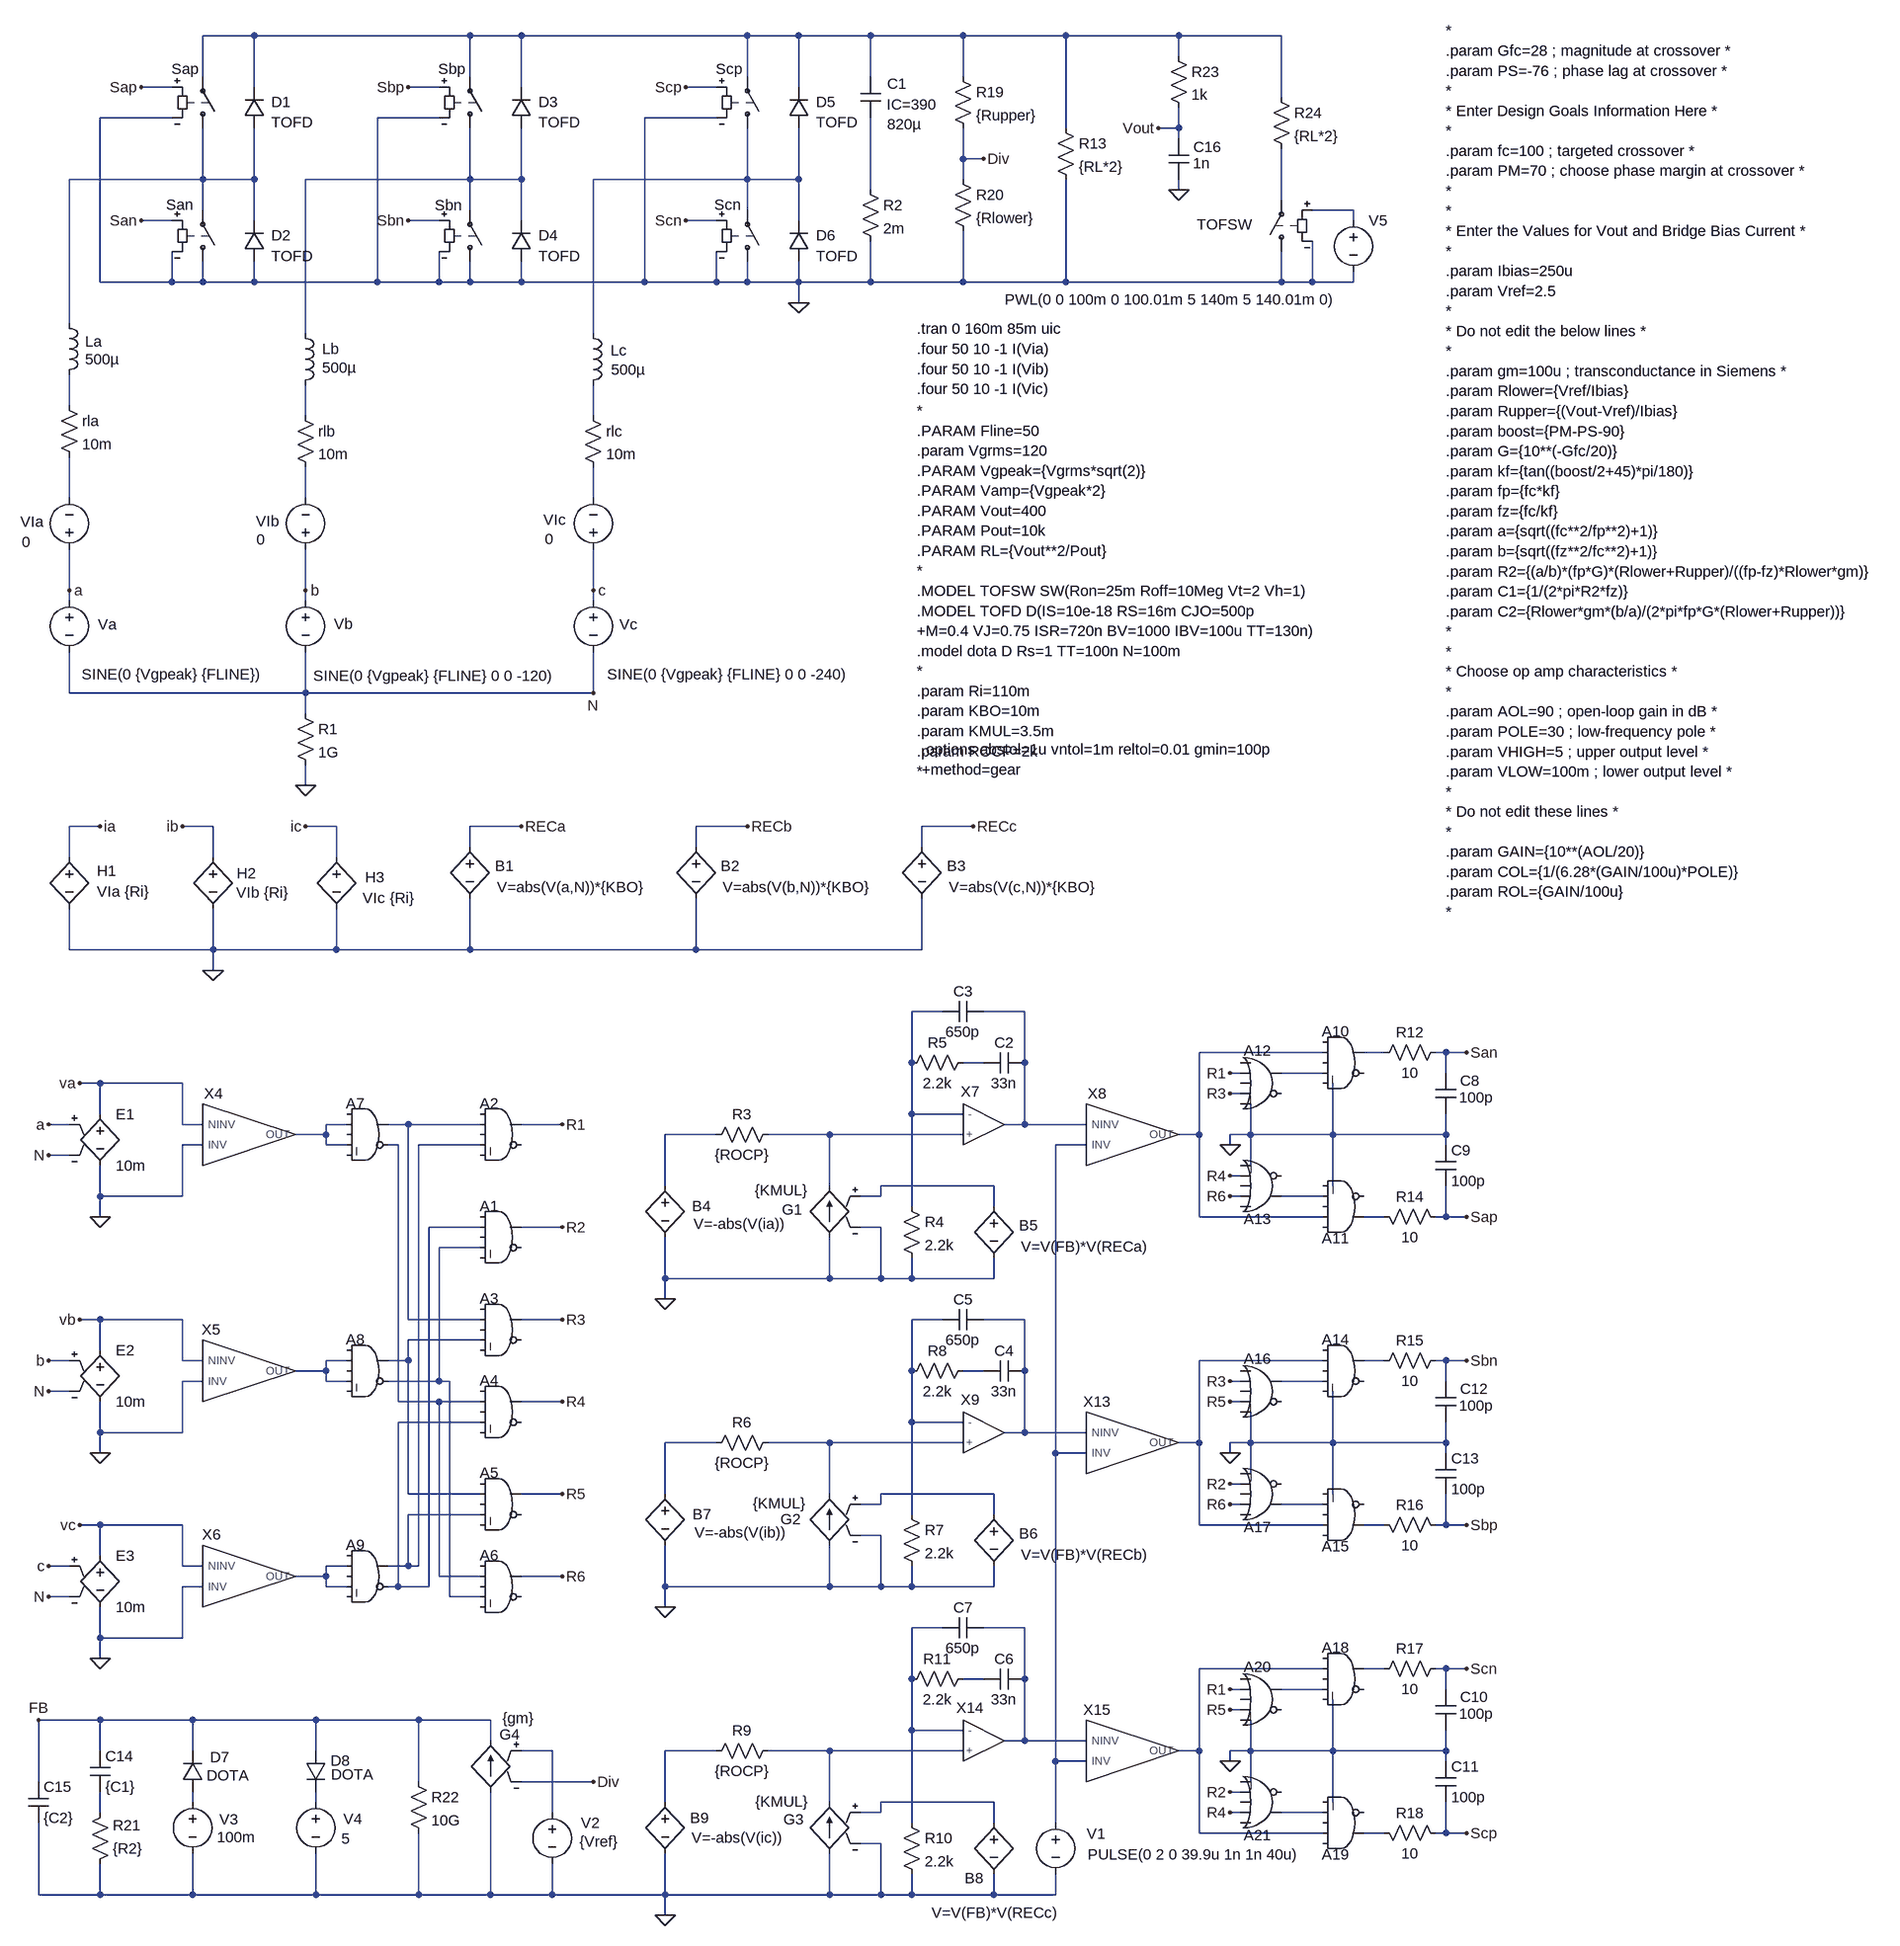
[diagram p0: schematic 3-phase PFC with switches - mul - load step.asc]
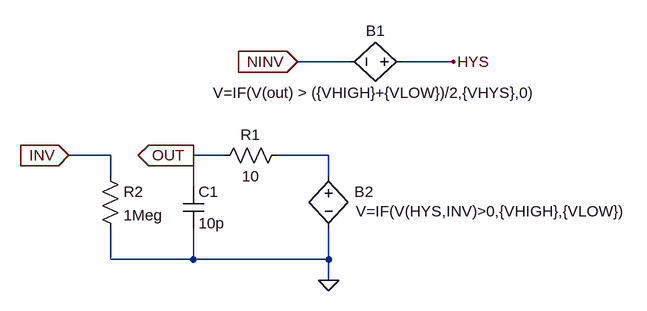
[diagram p1: sub-circuit comptof.asc]
3-phase PFC with switches - mul - load step.asc, the LTspice schematic file:
Version 4.1
SHEET 1 4380 2260
WIRE 320 -688 240 -688
WIRE 656 -688 320 -688
WIRE 736 -688 656 -688
WIRE 1088 -688 736 -688
WIRE 1168 -688 1088 -688
WIRE 1280 -688 1168 -688
WIRE 1424 -688 1280 -688
WIRE 1584 -688 1424 -688
WIRE 1760 -688 1584 -688
WIRE 1920 -688 1760 -688
WIRE 1760 -656 1760 -688
WIRE 240 -624 240 -688
WIRE 656 -624 656 -688
WIRE 1088 -624 1088 -688
WIRE 1280 -624 1280 -688
WIRE 1424 -624 1424 -688
WIRE 192 -608 144 -608
WIRE 320 -608 320 -688
WIRE 608 -608 560 -608
WIRE 736 -608 736 -688
WIRE 1040 -608 992 -608
WIRE 1168 -608 1168 -688
WIRE 1920 -592 1920 -688
WIRE 192 -560 80 -560
WIRE 608 -560 512 -560
WIRE 1040 -560 928 -560
WIRE 1584 -544 1584 -688
WIRE 1760 -544 1760 -576
WIRE 1760 -544 1728 -544
WIRE 1760 -528 1760 -544
WIRE 1424 -496 1424 -544
WIRE 1456 -496 1424 -496
WIRE 240 -464 240 -544
WIRE 240 -464 32 -464
WIRE 320 -464 320 -544
WIRE 320 -464 240 -464
WIRE 656 -464 656 -544
WIRE 656 -464 400 -464
WIRE 736 -464 736 -544
WIRE 736 -464 656 -464
WIRE 1088 -464 1088 -544
WIRE 1088 -464 848 -464
WIRE 1168 -464 1168 -544
WIRE 1168 -464 1088 -464
WIRE 1424 -464 1424 -496
WIRE 1280 -448 1280 -560
WIRE 1760 -448 1760 -464
WIRE 1920 -432 1920 -512
WIRE 240 -416 240 -464
WIRE 656 -416 656 -464
WIRE 1088 -416 1088 -464
WIRE 2032 -416 1968 -416
WIRE 192 -400 144 -400
WIRE 320 -400 320 -464
WIRE 608 -400 560 -400
WIRE 736 -400 736 -464
WIRE 1040 -400 992 -400
WIRE 1168 -400 1168 -464
WIRE 2032 -400 2032 -416
WIRE 80 -304 80 -560
WIRE 192 -304 192 -352
WIRE 192 -304 80 -304
WIRE 240 -304 240 -336
WIRE 240 -304 192 -304
WIRE 320 -304 320 -336
WIRE 320 -304 240 -304
WIRE 512 -304 512 -560
WIRE 512 -304 320 -304
WIRE 608 -304 608 -352
WIRE 608 -304 512 -304
WIRE 656 -304 656 -336
WIRE 656 -304 608 -304
WIRE 736 -304 736 -336
WIRE 736 -304 656 -304
WIRE 928 -304 928 -560
WIRE 928 -304 736 -304
WIRE 1040 -304 1040 -352
WIRE 1040 -304 928 -304
WIRE 1088 -304 1088 -336
WIRE 1088 -304 1040 -304
WIRE 1168 -304 1168 -336
WIRE 1168 -304 1088 -304
WIRE 1280 -304 1280 -368
WIRE 1280 -304 1168 -304
WIRE 1424 -304 1424 -384
WIRE 1424 -304 1280 -304
WIRE 1584 -304 1584 -464
WIRE 1584 -304 1424 -304
WIRE 1920 -304 1920 -352
WIRE 1920 -304 1584 -304
WIRE 1968 -304 1968 -368
WIRE 1968 -304 1920 -304
WIRE 2032 -304 2032 -320
WIRE 2032 -304 1968 -304
WIRE 1168 -272 1168 -304
WIRE 32 -240 32 -464
WIRE 400 -224 400 -464
WIRE 848 -224 848 -464
WIRE 32 -112 32 -160
WIRE 400 -96 400 -144
WIRE 848 -96 848 -144
WIRE 32 32 32 -32
WIRE 400 32 400 -16
WIRE 848 32 848 -16
WIRE 32 176 32 112
WIRE 400 176 400 112
WIRE 848 176 848 112
WIRE 32 192 32 176
WIRE 400 192 400 176
WIRE 848 192 848 176
WIRE 32 336 32 272
WIRE 400 336 400 272
WIRE 400 336 32 336
WIRE 848 336 848 272
WIRE 848 336 400 336
WIRE 400 368 400 336
WIRE 400 480 400 448
WIRE 80 544 32 544
WIRE 256 544 208 544
WIRE 448 544 400 544
WIRE 736 544 656 544
WIRE 1088 544 1008 544
WIRE 1440 544 1360 544
WIRE 656 576 656 544
WIRE 1008 576 1008 544
WIRE 1360 576 1360 544
WIRE 32 592 32 544
WIRE 256 592 256 544
WIRE 448 592 448 544
WIRE 32 736 32 672
WIRE 256 736 256 672
WIRE 256 736 32 736
WIRE 448 736 448 672
WIRE 448 736 256 736
WIRE 656 736 656 656
WIRE 656 736 448 736
WIRE 1008 736 1008 656
WIRE 1008 736 656 736
WIRE 1360 736 1360 656
WIRE 1360 736 1008 736
WIRE 256 768 256 736
WIRE 1392 832 1344 832
WIRE 1520 832 1456 832
WIRE 1984 896 1792 896
WIRE 2080 896 2048 896
WIRE 2176 896 2160 896
WIRE 2208 896 2176 896
WIRE 1344 912 1344 832
WIRE 1456 912 1424 912
WIRE 1520 912 1520 832
WIRE 1856 928 1840 928
WIRE 1984 928 1920 928
WIRE 2176 928 2176 896
WIRE 80 944 48 944
WIRE 208 944 80 944
WIRE 1856 960 1840 960
WIRE 80 992 80 944
WIRE 1344 992 1344 912
WIRE 1424 992 1344 992
WIRE 32 1008 0 1008
WIRE 208 1008 208 944
WIRE 240 1008 208 1008
WIRE 464 1008 432 1008
WIRE 560 1008 528 1008
WIRE 672 1008 560 1008
WIRE 800 1008 736 1008
WIRE 1520 1008 1520 912
WIRE 1520 1008 1488 1008
WIRE 1616 1008 1520 1008
WIRE 432 1024 432 1008
WIRE 432 1024 384 1024
WIRE 1040 1024 960 1024
WIRE 1216 1024 1120 1024
WIRE 1424 1024 1216 1024
WIRE 1792 1024 1792 896
WIRE 1792 1024 1760 1024
WIRE 1872 1024 1872 976
WIRE 1872 1024 1840 1024
WIRE 2000 1024 2000 944
WIRE 2000 1024 1872 1024
WIRE 2176 1024 2176 992
WIRE 2176 1024 2000 1024
WIRE 240 1040 208 1040
WIRE 432 1040 432 1024
WIRE 464 1040 432 1040
WIRE 544 1040 528 1040
WIRE 672 1040 576 1040
WIRE 1616 1040 1568 1040
WIRE 1840 1040 1840 1024
WIRE 2176 1040 2176 1024
WIRE 32 1056 0 1056
WIRE 1872 1072 1872 1024
WIRE 1856 1088 1840 1088
WIRE 960 1104 960 1024
WIRE 1216 1104 1216 1024
WIRE 1472 1104 1296 1104
WIRE 2000 1104 2000 1024
WIRE 80 1120 80 1072
WIRE 208 1120 208 1040
WIRE 208 1120 80 1120
WIRE 1296 1120 1296 1104
WIRE 1296 1120 1264 1120
WIRE 1856 1120 1840 1120
WIRE 1984 1120 1920 1120
WIRE 1344 1136 1344 992
WIRE 1472 1136 1472 1104
WIRE 80 1152 80 1120
WIRE 1792 1152 1792 1024
WIRE 1984 1152 1792 1152
WIRE 2080 1152 2048 1152
WIRE 2176 1152 2176 1104
WIRE 2176 1152 2160 1152
WIRE 2208 1152 2176 1152
WIRE 672 1168 592 1168
WIRE 800 1168 736 1168
WIRE 1296 1168 1264 1168
WIRE 672 1200 608 1200
WIRE 960 1248 960 1184
WIRE 1216 1248 1216 1184
WIRE 1216 1248 960 1248
WIRE 1296 1248 1296 1168
WIRE 1296 1248 1216 1248
WIRE 1344 1248 1344 1216
WIRE 1344 1248 1296 1248
WIRE 1472 1248 1472 1216
WIRE 1472 1248 1344 1248
WIRE 960 1280 960 1248
WIRE 80 1312 48 1312
WIRE 208 1312 80 1312
WIRE 560 1312 560 1008
WIRE 672 1312 560 1312
WIRE 800 1312 736 1312
WIRE 1392 1312 1344 1312
WIRE 1520 1312 1456 1312
WIRE 672 1344 560 1344
WIRE 80 1360 80 1312
WIRE 32 1376 0 1376
WIRE 208 1376 208 1312
WIRE 240 1376 208 1376
WIRE 464 1376 432 1376
WIRE 560 1376 560 1344
WIRE 560 1376 528 1376
WIRE 1984 1376 1792 1376
WIRE 2080 1376 2048 1376
WIRE 2176 1376 2160 1376
WIRE 2208 1376 2176 1376
WIRE 432 1392 432 1376
WIRE 432 1392 384 1392
WIRE 1344 1392 1344 1312
WIRE 1456 1392 1424 1392
WIRE 1520 1392 1520 1312
WIRE 240 1408 208 1408
WIRE 432 1408 432 1392
WIRE 464 1408 432 1408
WIRE 608 1408 608 1200
WIRE 608 1408 528 1408
WIRE 624 1408 608 1408
WIRE 1856 1408 1840 1408
WIRE 1984 1408 1920 1408
WIRE 2176 1408 2176 1376
WIRE 32 1424 0 1424
WIRE 544 1440 544 1040
WIRE 608 1440 544 1440
WIRE 672 1440 608 1440
WIRE 800 1440 736 1440
WIRE 1856 1440 1840 1440
WIRE 672 1472 544 1472
WIRE 1344 1472 1344 1392
WIRE 1424 1472 1344 1472
WIRE 80 1488 80 1440
WIRE 208 1488 208 1408
WIRE 208 1488 80 1488
WIRE 1520 1488 1520 1392
WIRE 1520 1488 1488 1488
WIRE 1616 1488 1520 1488
WIRE 1040 1504 960 1504
WIRE 1216 1504 1120 1504
WIRE 1424 1504 1216 1504
WIRE 1792 1504 1792 1376
WIRE 1792 1504 1760 1504
WIRE 1872 1504 1872 1456
WIRE 1872 1504 1840 1504
WIRE 2000 1504 2000 1424
WIRE 2000 1504 1872 1504
WIRE 2176 1504 2176 1472
WIRE 2176 1504 2000 1504
WIRE 80 1520 80 1488
WIRE 1568 1520 1568 1040
WIRE 1616 1520 1568 1520
WIRE 1840 1520 1840 1504
WIRE 2176 1520 2176 1504
WIRE 1872 1552 1872 1504
WIRE 1856 1568 1840 1568
WIRE 560 1584 560 1376
WIRE 672 1584 560 1584
WIRE 800 1584 736 1584
WIRE 960 1584 960 1504
WIRE 1216 1584 1216 1504
WIRE 1472 1584 1296 1584
WIRE 2000 1584 2000 1504
WIRE 1296 1600 1296 1584
WIRE 1296 1600 1264 1600
WIRE 1856 1600 1840 1600
WIRE 1984 1600 1920 1600
WIRE 672 1616 560 1616
WIRE 1344 1616 1344 1472
WIRE 1472 1616 1472 1584
WIRE 80 1632 48 1632
WIRE 208 1632 80 1632
WIRE 1792 1632 1792 1504
WIRE 1984 1632 1792 1632
WIRE 2080 1632 2048 1632
WIRE 2176 1632 2176 1584
WIRE 2176 1632 2160 1632
WIRE 2208 1632 2176 1632
WIRE 1296 1648 1264 1648
WIRE 80 1680 80 1632
WIRE 32 1696 0 1696
WIRE 208 1696 208 1632
WIRE 240 1696 208 1696
WIRE 464 1696 432 1696
WIRE 560 1696 560 1616
WIRE 560 1696 528 1696
WIRE 576 1696 576 1040
WIRE 576 1696 560 1696
WIRE 432 1712 432 1696
WIRE 432 1712 384 1712
WIRE 608 1712 608 1440
WIRE 672 1712 608 1712
WIRE 800 1712 736 1712
WIRE 240 1728 208 1728
WIRE 432 1728 432 1712
WIRE 464 1728 432 1728
WIRE 544 1728 544 1472
WIRE 544 1728 528 1728
WIRE 592 1728 592 1168
WIRE 592 1728 544 1728
WIRE 960 1728 960 1664
WIRE 1216 1728 1216 1664
WIRE 1216 1728 960 1728
WIRE 1296 1728 1296 1648
WIRE 1296 1728 1216 1728
WIRE 1344 1728 1344 1696
WIRE 1344 1728 1296 1728
WIRE 1472 1728 1472 1696
WIRE 1472 1728 1344 1728
WIRE 32 1744 0 1744
WIRE 624 1744 624 1408
WIRE 672 1744 624 1744
WIRE 960 1760 960 1728
WIRE 1392 1792 1344 1792
WIRE 1520 1792 1456 1792
WIRE 80 1808 80 1760
WIRE 208 1808 208 1728
WIRE 208 1808 80 1808
WIRE 80 1840 80 1808
WIRE 1984 1856 1792 1856
WIRE 2080 1856 2048 1856
WIRE 2176 1856 2160 1856
WIRE 2208 1856 2176 1856
WIRE 1344 1872 1344 1792
WIRE 1456 1872 1424 1872
WIRE 1520 1872 1520 1792
WIRE 1856 1888 1840 1888
WIRE 1984 1888 1920 1888
WIRE 2176 1888 2176 1856
WIRE 1856 1920 1840 1920
WIRE 80 1936 -16 1936
WIRE 224 1936 80 1936
WIRE 416 1936 224 1936
WIRE 576 1936 416 1936
WIRE 688 1936 576 1936
WIRE 1344 1952 1344 1872
WIRE 1424 1952 1344 1952
WIRE 688 1968 688 1936
WIRE 1520 1968 1520 1872
WIRE 1520 1968 1488 1968
WIRE 1616 1968 1520 1968
WIRE 80 1984 80 1936
WIRE 224 1984 224 1936
WIRE 416 1984 416 1936
WIRE 784 1984 736 1984
WIRE 1040 1984 960 1984
WIRE 1216 1984 1120 1984
WIRE 1424 1984 1216 1984
WIRE 1792 1984 1792 1856
WIRE 1792 1984 1760 1984
WIRE 1872 1984 1872 1936
WIRE 1872 1984 1840 1984
WIRE 2000 1984 2000 1904
WIRE 2000 1984 1872 1984
WIRE 2176 1984 2176 1952
WIRE 2176 1984 2000 1984
WIRE 1568 2000 1568 1520
WIRE 1616 2000 1568 2000
WIRE 1840 2000 1840 1984
WIRE 2176 2000 2176 1984
WIRE -16 2032 -16 1936
WIRE 576 2032 576 1936
WIRE 848 2032 736 2032
WIRE 1872 2032 1872 1984
WIRE 1856 2048 1840 2048
WIRE 224 2064 224 2048
WIRE 416 2064 416 2048
WIRE 960 2064 960 1984
WIRE 1216 2064 1216 1984
WIRE 1472 2064 1296 2064
WIRE 2000 2064 2000 1984
WIRE 80 2080 80 2048
WIRE 784 2080 784 1984
WIRE 1296 2080 1296 2064
WIRE 1296 2080 1264 2080
WIRE 1856 2080 1840 2080
WIRE 1984 2080 1920 2080
WIRE 1344 2096 1344 1952
WIRE 1472 2096 1472 2064
WIRE 1568 2096 1568 2000
WIRE 1792 2112 1792 1984
WIRE 1984 2112 1792 2112
WIRE 2080 2112 2048 2112
WIRE 2176 2112 2176 2064
WIRE 2176 2112 2160 2112
WIRE 2208 2112 2176 2112
WIRE 1296 2128 1264 2128
WIRE -16 2208 -16 2096
WIRE 80 2208 80 2160
WIRE 80 2208 -16 2208
WIRE 224 2208 224 2144
WIRE 224 2208 80 2208
WIRE 416 2208 416 2144
WIRE 416 2208 224 2208
WIRE 576 2208 576 2112
WIRE 576 2208 416 2208
WIRE 688 2208 688 2048
WIRE 688 2208 576 2208
WIRE 784 2208 784 2160
WIRE 784 2208 688 2208
WIRE 960 2208 960 2144
WIRE 960 2208 784 2208
WIRE 1216 2208 1216 2144
WIRE 1216 2208 960 2208
WIRE 1296 2208 1296 2128
WIRE 1296 2208 1216 2208
WIRE 1344 2208 1344 2176
WIRE 1344 2208 1296 2208
WIRE 1472 2208 1472 2176
WIRE 1472 2208 1344 2208
WIRE 1568 2208 1568 2176
WIRE 1568 2208 1472 2208
WIRE 960 2240 960 2208
FLAG 400 480 0
FLAG 80 544 ia
FLAG 208 544 ib
FLAG 400 544 ic
FLAG 32 176 a
FLAG 400 176 b
FLAG 848 176 c
FLAG 256 768 0
FLAG 144 -608 Sap
FLAG 144 -400 San
FLAG 560 -608 Sbp
FLAG 560 -400 Sbn
FLAG 992 -608 Scp
FLAG 992 -400 Scn
FLAG 48 944 va
FLAG 848 336 N
FLAG 0 1056 N
FLAG 0 1008 a
FLAG 48 1312 vb
FLAG 0 1424 N
FLAG 0 1376 b
FLAG 48 1632 vc
FLAG 0 1744 N
FLAG 0 1696 c
FLAG 1168 -272 0
FLAG 80 1152 0
FLAG 80 1520 0
FLAG 80 1840 0
FLAG 800 1008 R1
FLAG 800 1168 R2
FLAG 800 1312 R3
FLAG 800 1440 R4
FLAG 800 1584 R5
FLAG 800 1712 R6
FLAG 736 544 RECa
FLAG 1088 544 RECb
FLAG 1440 544 RECc
FLAG 960 1280 0
FLAG 960 1760 0
FLAG 960 2240 0
FLAG 2208 896 San
FLAG 2208 1152 Sap
FLAG 1840 928 R1
FLAG 1840 960 R3
FLAG 1840 1088 R4
FLAG 1840 1120 R6
FLAG 2208 1376 Sbn
FLAG 2208 1632 Sbp
FLAG 1840 1408 R3
FLAG 1840 1440 R5
FLAG 1840 1568 R2
FLAG 1840 1600 R6
FLAG 2208 1856 Scn
FLAG 2208 2112 Scp
FLAG 1840 1888 R1
FLAG 1840 1920 R5
FLAG 1840 2048 R2
FLAG 1840 2080 R4
FLAG 1840 1040 0
FLAG 1840 1520 0
FLAG 1840 2000 0
FLAG 1456 -496 Div
FLAG -16 1936 FB
FLAG 848 2032 Div
FLAG 1760 -448 0
FLAG 1728 -544 Vout
SYMBOL voltage 32 176 R0
WINDOW 0 45 53 Left 2
WINDOW 3 19 131 Left 2
WINDOW 123 0 0 Left 0
WINDOW 39 0 0 Left 0
SYMATTR InstName Va
SYMATTR Value SINE(0 {Vgpeak} {FLINE})
SYMBOL voltage 400 176 R0
WINDOW 0 44 52 Left 2
WINDOW 3 12 133 Left 2
WINDOW 123 0 0 Left 0
WINDOW 39 0 0 Left 0
SYMATTR InstName Vb
SYMATTR Value SINE(0 {Vgpeak} {FLINE} 0 0 -120)
SYMBOL voltage 848 176 R0
WINDOW 0 41 53 Left 2
WINDOW 3 22 131 Left 2
WINDOW 123 0 0 Left 0
WINDOW 39 0 0 Left 0
SYMATTR InstName Vc
SYMATTR Value SINE(0 {Vgpeak} {FLINE} 0 0 -240)
SYMBOL res 384 352 R0
SYMATTR InstName R1
SYMATTR Value 1G
SYMBOL res 16 -128 R0
SYMATTR InstName rla
SYMATTR Value 10m
SYMBOL res 384 -112 R0
SYMATTR InstName rlb
SYMATTR Value 10m
SYMBOL res 832 -112 R0
SYMATTR InstName rlc
SYMATTR Value 10m
SYMBOL h 32 576 R0
WINDOW 0 43 37 Left 2
WINDOW 3 43 69 Left 2
SYMATTR InstName H1
SYMATTR Value VIa {Ri}
SYMBOL h 256 576 R0
WINDOW 0 37 41 Left 2
WINDOW 3 36 71 Left 2
SYMATTR InstName H2
SYMATTR Value VIb {Ri}
SYMBOL h 448 576 R0
WINDOW 0 45 47 Left 2
WINDOW 3 41 79 Left 2
SYMATTR InstName H3
SYMATTR Value VIc {Ri}
SYMBOL ind 16 -256 R0
WINDOW 0 41 44 Left 2
WINDOW 3 41 72 Left 2
SYMATTR InstName La
SYMATTR Value 500µ
SYMBOL ind 384 -240 R0
WINDOW 0 42 40 Left 2
WINDOW 3 42 69 Left 2
SYMATTR InstName Lb
SYMATTR Value 500µ
SYMBOL ind 832 -240 R0
WINDOW 0 43 42 Left 2
WINDOW 3 44 72 Left 2
SYMATTR InstName Lc
SYMATTR Value 500µ
SYMBOL voltage 32 128 R180
WINDOW 0 40 59 Left 2
WINDOW 3 60 27 Left 2
WINDOW 123 0 0 Left 0
WINDOW 39 0 0 Left 0
SYMATTR InstName VIa
SYMATTR Value 0
SYMBOL voltage 400 128 R180
WINDOW 0 41 60 Left 2
WINDOW 3 63 31 Left 2
WINDOW 123 0 0 Left 0
WINDOW 39 0 0 Left 0
SYMATTR InstName VIb
SYMATTR Value 0
SYMBOL voltage 848 128 R180
WINDOW 0 43 62 Left 2
WINDOW 3 62 32 Left 2
WINDOW 123 0 0 Left 0
WINDOW 39 0 0 Left 0
SYMATTR InstName VIc
SYMATTR Value 0
SYMBOL sw 240 -528 M180
WINDOW 3 47 44 Invisible 2
WINDOW 0 -49 108 Left 2
SYMATTR Value TOFSW
SYMATTR InstName Sap
SYMBOL sw 240 -320 M180
WINDOW 3 41 43 Invisible 2
WINDOW 0 -57 105 Left 2
SYMATTR Value TOFSW
SYMATTR InstName San
SYMBOL sw 656 -528 M180
WINDOW 3 47 44 Invisible 2
WINDOW 0 -49 108 Left 2
SYMATTR Value TOFSW
SYMATTR InstName Sbp
SYMBOL sw 656 -320 M180
WINDOW 3 41 43 Invisible 2
WINDOW 0 -55 104 Left 2
SYMATTR Value TOFSW
SYMATTR InstName Sbn
SYMBOL sw 1088 -528 M180
WINDOW 3 47 44 Invisible 2
WINDOW 0 -49 108 Left 2
SYMATTR Value TOFSW
SYMATTR InstName Scp
SYMBOL sw 1088 -320 M180
WINDOW 3 41 43 Invisible 2
WINDOW 0 -51 105 Left 2
SYMATTR Value TOFSW
SYMATTR InstName Scn
SYMBOL cap 1264 -624 R0
WINDOW 0 42 11 Left 2
WINDOW 3 42 74 Left 2
WINDOW 123 41 43 Left 2
SYMATTR InstName C1
SYMATTR Value 820µ
SYMATTR Value2 IC=390
SYMBOL res 1264 -464 R0
SYMATTR InstName R2
SYMATTR Value 2m
SYMBOL e 80 976 R0
SYMATTR InstName E1
SYMATTR Value 10m
SYMBOL e 80 1344 R0
SYMATTR InstName E2
SYMATTR Value 10m
SYMBOL e 80 1664 R0
SYMATTR InstName E3
SYMATTR Value 10m
SYMBOL res 1568 -560 R0
SYMATTR InstName R13
SYMATTR Value {RL*2}
SYMBOL diode 304 -544 M180
WINDOW 0 43 41 Left 2
WINDOW 3 43 9 Left 2
SYMATTR InstName D1
SYMATTR Value TOFD
SYMBOL diode 304 -336 M180
WINDOW 0 43 41 Left 2
WINDOW 3 43 9 Left 2
SYMATTR InstName D2
SYMATTR Value TOFD
SYMBOL diode 720 -544 M180
WINDOW 0 43 41 Left 2
WINDOW 3 43 9 Left 2
SYMATTR InstName D3
SYMATTR Value TOFD
SYMBOL diode 720 -336 M180
WINDOW 0 43 41 Left 2
WINDOW 3 43 9 Left 2
SYMATTR InstName D4
SYMATTR Value TOFD
SYMBOL diode 1152 -544 M180
WINDOW 0 43 41 Left 2
WINDOW 3 43 9 Left 2
SYMATTR InstName D5
SYMATTR Value TOFD
SYMBOL diode 1152 -336 M180
WINDOW 0 43 41 Left 2
WINDOW 3 43 9 Left 2
SYMATTR InstName D6
SYMATTR Value TOFD
SYMBOL TOF\\3Phase\\6\ pack\ -\ multipliers\\COMPTOF 304 1024 M180
WINDOW 0 -47 80 Bottom 2
SYMATTR InstName X4
SYMATTR SpiceLine VHIGH=5 VLOW=100m VHYS=10m
SYMBOL Digital\\and 704 960 R0
WINDOW 0 -33 15 Left 2
SYMATTR InstName A2
SYMATTR SpiceLine Vhigh=5 Vlow=0 Ref=2.5
SYMBOL Digital\\and 704 1120 R0
WINDOW 0 -33 15 Left 2
SYMATTR InstName A1
SYMATTR SpiceLine Vhigh=5 Vlow=0 Ref=2.5
SYMBOL Digital\\and 704 1264 R0
WINDOW 0 -33 15 Left 2
SYMATTR InstName A3
SYMATTR SpiceLine Vhigh=5 Vlow=0 Ref=2.5
SYMBOL Digital\\and 704 1392 R0
WINDOW 0 -33 15 Left 2
SYMATTR InstName A4
SYMATTR SpiceLine Vhigh=5 Vlow=0 Ref=2.5
SYMBOL Digital\\and 704 1536 R0
WINDOW 0 -33 15 Left 2
SYMATTR InstName A5
SYMATTR SpiceLine Vhigh=5 Vlow=0 Ref=2.5
SYMBOL Digital\\and 704 1664 R0
WINDOW 0 -33 15 Left 2
SYMATTR InstName A6
SYMATTR SpiceLine Vhigh=5 Vlow=0 Ref=2.5
SYMBOL Digital\\and 496 960 R0
WINDOW 0 -33 15 Left 2
SYMATTR InstName A7
SYMATTR SpiceLine Vhigh=5 Vlow=0 Ref=2.5
SYMBOL TOF\\3Phase\\6\ pack\ -\ multipliers\\COMPTOF 304 1392 M180
WINDOW 0 -51 80 Bottom 2
SYMATTR InstName X5
SYMATTR SpiceLine VHIGH=5 VLOW=100m VHYS=10m
SYMBOL Digital\\and 496 1328 R0
WINDOW 0 -33 15 Left 2
SYMATTR InstName A8
SYMATTR SpiceLine Vhigh=5 Vlow=0 Ref=2.5
SYMBOL TOF\\3Phase\\6\ pack\ -\ multipliers\\COMPTOF 304 1712 M180
WINDOW 0 -50 81 Bottom 2
SYMATTR InstName X6
SYMATTR SpiceLine VHIGH=5 VLOW=100m VHYS=10m
SYMBOL Digital\\and 496 1648 R0
WINDOW 0 -33 15 Left 2
SYMATTR InstName A9
SYMATTR SpiceLine Vhigh=5 Vlow=0 Ref=2.5
SYMBOL bv 656 560 R0
WINDOW 0 39 45 Left 2
WINDOW 3 42 78 Left 2
SYMATTR InstName B1
SYMATTR Value V=abs(V(a,N))*{KBO}
SYMBOL bv 1008 560 R0
WINDOW 0 39 45 Left 2
WINDOW 3 42 78 Left 2
SYMATTR InstName B2
SYMATTR Value V=abs(V(b,N))*{KBO}
SYMBOL bv 1360 560 R0
WINDOW 0 39 45 Left 2
WINDOW 3 42 78 Left 2
SYMATTR InstName B3
SYMATTR Value V=abs(V(c,N))*{KBO}
SYMBOL bv 960 1088 R0
WINDOW 0 42 47 Left 2
WINDOW 3 44 75 Left 2
SYMATTR InstName B4
SYMATTR Value V=-abs(V(ia))
SYMBOL res 1136 1008 R90
WINDOW 0 0 56 VBottom 2
WINDOW 3 32 56 VTop 2
SYMATTR InstName R3
SYMATTR Value {ROCP}
SYMBOL opampTOF 1488 992 R0
WINDOW 0 -53 -20 Bottom 2
SYMATTR InstName X7
SYMATTR SpiceLine Vhigh=1.9 Vlow={VLOW} Col={COL} Rol={ROL}
SYMBOL res 1328 1120 R0
SYMATTR InstName R4
SYMATTR Value 2.2k
SYMBOL res 1440 896 R90
WINDOW 0 0 56 VBottom 2
WINDOW 3 32 56 VTop 2
SYMATTR InstName R5
SYMATTR Value 2.2k
SYMBOL cap 1520 896 R90
WINDOW 0 0 32 VBottom 2
WINDOW 3 32 32 VTop 2
SYMATTR InstName C2
SYMATTR Value 33n
SYMBOL cap 1456 816 R90
WINDOW 0 0 32 VBottom 2
WINDOW 3 32 32 VTop 2
SYMATTR InstName C3
SYMATTR Value 650p
SYMBOL TOF\\3Phase\\6\ pack\ -\ multipliers\\COMPTOF 1680 1024 M180
WINDOW 0 -47 80 Bottom 2
SYMATTR InstName X8
SYMATTR SpiceLine VHIGH=5 VLOW=100m VHYS=10m
SYMBOL g 1216 1088 M0
WINDOW 0 42 53 Left 2
WINDOW 3 33 23 Left 2
SYMATTR InstName G1
SYMATTR Value {KMUL}
SYMBOL bv 1472 1120 R0
WINDOW 0 39 45 Left 2
WINDOW 3 42 78 Left 2
SYMATTR InstName B5
SYMATTR Value V=V(FB)*V(RECa)
SYMBOL res 1136 1488 R90
WINDOW 0 0 56 VBottom 2
WINDOW 3 32 56 VTop 2
SYMATTR InstName R6
SYMATTR Value {ROCP}
SYMBOL opampTOF 1488 1472 R0
WINDOW 0 -53 -20 Bottom 2
SYMATTR InstName X9
SYMATTR SpiceLine Vhigh=1.9 Vlow={VLOW} Col={COL} Rol={ROL}
SYMBOL res 1328 1600 R0
SYMATTR InstName R7
SYMATTR Value 2.2k
SYMBOL res 1440 1376 R90
WINDOW 0 0 56 VBottom 2
WINDOW 3 32 56 VTop 2
SYMATTR InstName R8
SYMATTR Value 2.2k
SYMBOL cap 1520 1376 R90
WINDOW 0 0 32 VBottom 2
WINDOW 3 32 32 VTop 2
SYMATTR InstName C4
SYMATTR Value 33n
SYMBOL cap 1456 1296 R90
WINDOW 0 0 32 VBottom 2
WINDOW 3 32 32 VTop 2
SYMATTR InstName C5
SYMATTR Value 650p
SYMBOL TOF\\3Phase\\6\ pack\ -\ multipliers\\COMPTOF 1680 1504 M180
WINDOW 0 -47 80 Bottom 2
SYMATTR InstName X13
SYMATTR SpiceLine VHIGH=5 VLOW=100m VHYS=10m
SYMBOL g 1216 1568 M0
WINDOW 0 44 55 Left 2
WINDOW 3 36 30 Left 2
SYMATTR InstName G2
SYMATTR Value {KMUL}
SYMBOL bv 1472 1600 R0
WINDOW 0 39 45 Left 2
WINDOW 3 42 78 Left 2
SYMATTR InstName B6
SYMATTR Value V=V(FB)*V(RECb)
SYMBOL bv 960 1568 R0
WINDOW 0 43 47 Left 2
WINDOW 3 46 76 Left 2
SYMATTR InstName B7
SYMATTR Value V=-abs(V(ib))
SYMBOL res 1136 1968 R90
WINDOW 0 0 56 VBottom 2
WINDOW 3 32 56 VTop 2
SYMATTR InstName R9
SYMATTR Value {ROCP}
SYMBOL opampTOF 1488 1952 R0
WINDOW 0 -53 -20 Bottom 2
SYMATTR InstName X14
SYMATTR SpiceLine Vhigh=1.9 Vlow={VLOW} Col={COL} Rol={ROL}
SYMBOL res 1328 2080 R0
SYMATTR InstName R10
SYMATTR Value 2.2k
SYMBOL res 1440 1856 R90
WINDOW 0 0 56 VBottom 2
WINDOW 3 32 56 VTop 2
SYMATTR InstName R11
SYMATTR Value 2.2k
SYMBOL cap 1520 1856 R90
WINDOW 0 0 32 VBottom 2
WINDOW 3 32 32 VTop 2
SYMATTR InstName C6
SYMATTR Value 33n
SYMBOL TOF\\3Phase\\6\ pack\ -\ multipliers\\COMPTOF 1680 1984 M180
WINDOW 0 -47 80 Bottom 2
SYMATTR InstName X15
SYMATTR SpiceLine VHIGH=5 VLOW=100m VHYS=10m
SYMBOL g 1216 2048 M0
WINDOW 0 39 43 Left 2
WINDOW 3 32 15 Left 2
SYMATTR InstName G3
SYMATTR Value {KMUL}
SYMBOL bv 1472 2080 R0
WINDOW 0 -45 102 Left 2
WINDOW 3 -97 156 Left 2
SYMATTR InstName B8
SYMATTR Value V=V(FB)*V(RECc)
SYMBOL bv 960 2048 R0
WINDOW 0 39 40 Left 2
WINDOW 3 41 71 Left 2
SYMATTR InstName B9
SYMATTR Value V=-abs(V(ic))
SYMBOL cap 1456 1776 R90
WINDOW 0 0 32 VBottom 2
WINDOW 3 32 32 VTop 2
SYMATTR InstName C7
SYMATTR Value 650p
SYMBOL voltage 1568 2080 R0
WINDOW 0 49 33 Left 2
WINDOW 3 50 65 Left 2
WINDOW 123 0 0 Left 0
WINDOW 39 0 0 Left 0
SYMATTR InstName V1
SYMATTR Value PULSE(0 2 0 39.9u 1n 1n 40u)
SYMBOL Digital\\and 2016 848 R0
WINDOW 0 -33 15 Left 2
SYMATTR InstName A10
SYMATTR SpiceLine Vhigh=5 Vlow=0 Ref=2.5
SYMBOL Digital\\and 2016 1200 M180
WINDOW 0 -33 15 Left 2
SYMATTR InstName A11
SYMATTR SpiceLine Vhigh=5 Vlow=0 Ref=2.5
SYMBOL Digital\\or 1888 880 R0
WINDOW 0 -27 13 Left 2
SYMATTR InstName A12
SYMATTR SpiceLine Vhigh=5 Vlow=0 Ref=2.5
SYMBOL Digital\\or 1888 1168 M180
WINDOW 0 -27 13 Left 2
SYMATTR InstName A13
SYMATTR SpiceLine Vhigh=5 Vlow=0 Ref=2.5
SYMBOL Digital\\and 2016 1328 R0
WINDOW 0 -33 15 Left 2
SYMATTR InstName A14
SYMATTR SpiceLine Vhigh=5 Vlow=0 Ref=2.5
SYMBOL Digital\\and 2016 1680 M180
WINDOW 0 -33 15 Left 2
SYMATTR InstName A15
SYMATTR SpiceLine Vhigh=5 Vlow=0 Ref=2.5
SYMBOL Digital\\or 1888 1360 R0
WINDOW 0 -27 13 Left 2
SYMATTR InstName A16
SYMATTR SpiceLine Vhigh=5 Vlow=0 Ref=2.5
SYMBOL Digital\\or 1888 1648 M180
WINDOW 0 -27 13 Left 2
SYMATTR InstName A17
SYMATTR SpiceLine Vhigh=5 Vlow=0 Ref=2.5
SYMBOL Digital\\and 2016 1808 R0
WINDOW 0 -33 15 Left 2
SYMATTR InstName A18
SYMATTR SpiceLine Vhigh=5 Vlow=0 Ref=2.5
SYMBOL Digital\\and 2016 2160 M180
WINDOW 0 -33 15 Left 2
SYMATTR InstName A19
SYMATTR SpiceLine Vhigh=5 Vlow=0 Ref=2.5
SYMBOL Digital\\or 1888 1840 R0
WINDOW 0 -27 13 Left 2
SYMATTR InstName A20
SYMATTR SpiceLine Vhigh=5 Vlow=0 Ref=2.5
SYMBOL Digital\\or 1888 2128 M180
WINDOW 0 -27 13 Left 2
SYMATTR InstName A21
SYMATTR SpiceLine Vhigh=5 Vlow=0 Ref=2.5
SYMBOL res 2176 880 R90
WINDOW 0 0 56 VBottom 2
WINDOW 3 32 56 VTop 2
SYMATTR InstName R12
SYMATTR Value 10
SYMBOL cap 2160 928 R0
WINDOW 0 38 12 Left 2
WINDOW 3 37 38 Left 2
SYMATTR InstName C8
SYMATTR Value 100p
SYMBOL res 2176 1168 M270
WINDOW 0 32 56 VTop 2
WINDOW 3 0 56 VBottom 2
SYMATTR InstName R14
SYMATTR Value 10
SYMBOL cap 2160 1104 M180
WINDOW 0 24 56 Left 2
WINDOW 3 24 8 Left 2
SYMATTR InstName C9
SYMATTR Value 100p
SYMBOL res 2176 1360 R90
WINDOW 0 0 56 VBottom 2
WINDOW 3 32 56 VTop 2
SYMATTR InstName R15
SYMATTR Value 10
SYMBOL res 2176 1648 M270
WINDOW 0 32 56 VTop 2
WINDOW 3 0 56 VBottom 2
SYMATTR InstName R16
SYMATTR Value 10
SYMBOL res 2176 1840 R90
WINDOW 0 0 56 VBottom 2
WINDOW 3 32 56 VTop 2
SYMATTR InstName R17
SYMATTR Value 10
SYMBOL res 2176 2128 M270
WINDOW 0 32 56 VTop 2
WINDOW 3 0 56 VBottom 2
SYMATTR InstName R18
SYMATTR Value 10
SYMBOL cap 2160 1888 R0
WINDOW 0 38 12 Left 2
WINDOW 3 37 38 Left 2
SYMATTR InstName C10
SYMATTR Value 100p
SYMBOL cap 2160 2064 M180
WINDOW 0 24 56 Left 2
WINDOW 3 24 8 Left 2
SYMATTR InstName C11
SYMATTR Value 100p
SYMBOL cap 2160 1408 R0
WINDOW 0 38 12 Left 2
WINDOW 3 37 38 Left 2
SYMATTR InstName C12
SYMATTR Value 100p
SYMBOL cap 2160 1584 M180
WINDOW 0 24 56 Left 2
WINDOW 3 24 8 Left 2
SYMATTR InstName C13
SYMATTR Value 100p
SYMBOL res 1408 -640 R0
SYMATTR InstName R19
SYMATTR Value {Rupper}
SYMBOL res 1408 -480 R0
SYMATTR InstName R20
SYMATTR Value {Rlower}
SYMBOL voltage 784 2064 R0
WINDOW 0 45 32 Left 2
WINDOW 3 43 61 Left 2
WINDOW 123 0 0 Left 0
WINDOW 39 0 0 Left 0
SYMATTR InstName V2
SYMATTR Value {Vref}
SYMBOL cap 64 2048 M180
WINDOW 0 24 56 Left 2
WINDOW 3 24 8 Left 2
SYMATTR InstName C14
SYMATTR Value {C1}
SYMBOL res 64 2176 M180
WINDOW 0 36 76 Left 2
WINDOW 3 36 40 Left 2
SYMATTR InstName R21
SYMATTR Value {R2}
SYMBOL cap -32 2096 M180
WINDOW 0 24 56 Left 2
WINDOW 3 24 8 Left 2
SYMATTR InstName C15
SYMATTR Value {C2}
SYMBOL g 688 1952 M0
WINDOW 0 -46 6 Left 2
WINDOW 3 -69 -19 Left 2
SYMATTR InstName G4
SYMATTR Value {gm}
SYMBOL res 560 2016 R0
SYMATTR InstName R22
SYMATTR Value 10G
SYMBOL voltage 224 2048 R0
WINDOW 0 42 43 Left 2
WINDOW 3 38 70 Left 2
WINDOW 123 0 0 Left 0
WINDOW 39 0 0 Left 0
SYMATTR InstName V3
SYMATTR Value 100m
SYMBOL voltage 416 2048 R0
WINDOW 0 43 42 Left 2
WINDOW 3 40 73 Left 2
SYMATTR InstName V4
SYMATTR Value 5
SYMBOL diode 240 2048 R180
WINDOW 0 -42 54 Left 2
WINDOW 3 -73 26 Left 2
SYMATTR InstName D7
SYMATTR Value DOTA
SYMBOL diode 400 1984 R0
WINDOW 0 39 15 Left 2
WINDOW 3 40 37 Left 2
SYMATTR InstName D8
SYMATTR Value DOTA
SYMBOL res 1744 -672 R0
SYMATTR InstName R23
SYMATTR Value 1k
SYMBOL cap 1744 -528 R0
WINDOW 0 39 13 Left 2
WINDOW 3 38 39 Left 2
SYMATTR InstName C16
SYMATTR Value 1n
SYMBOL sw 1920 -336 R180
WINDOW 3 47 44 Invisible 2
WINDOW 0 45 58 Left 2
SYMATTR Value TOFSW
SYMATTR InstName TOFSW
SYMBOL res 1904 -608 R0
SYMATTR InstName R24
SYMATTR Value {RL*2}
SYMBOL voltage 2032 -416 R0
WINDOW 3 -543 139 Left 2
WINDOW 123 0 0 Left 0
WINDOW 39 0 0 Left 0
SYMATTR Value PWL(0 0 100m 0 100.01m 5 140m 5 140.01m 0)
SYMATTR InstName V5
TEXT 1352 -104 Left 2 !*\n.PARAM Fline=50\n.param Vgrms=120\n.PARAM Vgpeak={Vgrms*sqrt(2)}\n.PARAM Vamp={Vgpeak*2}\n.PARAM Vout=400\n.PARAM Pout=10k\n.PARAM RL={Vout**2/Pout}\n*\n.MODEL TOFSW SW(Ron=25m Roff=10Meg Vt=2 Vh=1)\n.MODEL TOFD D(IS=10e-18 RS=16m CJO=500p \n+M=0.4 VJ=0.75 ISR=720n BV=1000 IBV=100u TT=130n)\n.model dota D Rs=1 TT=100n N=100m\n*\n.param Ri=110m\n.param KBO=10m\n.param KMUL=3.5m\n.param ROCP=2k\n*
TEXT 1352 -232 Left 2 !.tran 0 160m 85m uic
TEXT 1352 -200 Left 2 !.four 50 10 -1 I(Via)\n.four 50 10 -1 I(Vib)\n.four 50 10 -1 I(Vic)
TEXT 1360 424 Left 2 !.options abstol=1u vntol=1m reltol=0.01 gmin=100p\n+method=gear
TEXT 2176 -696 Left 2 !*\n.param Gfc=28 ; magnitude at crossover *\n.param PS=-76 ; phase lag at crossover *\n*\n* Enter Design Goals Information Here *\n*\n.param fc=100 ; targeted crossover *\n.param PM=70 ; choose phase margin at crossover *\n*\n*\n* Enter the Values for Vout and Bridge Bias Current *\n*\n.param Ibias=250u\n.param Vref=2.5\n*\n* Do not edit the below lines *\n*\n.param gm=100u ; transconductance in Siemens *\n.param Rlower={Vref/Ibias}\n.param Rupper={(Vout-Vref)/Ibias}\n.param boost={PM-PS-90}\n.param G={10**(-Gfc/20)}\n.param kf={tan((boost/2+45)*pi/180)}\n.param fp={fc*kf}\n.param fz={fc/kf}\n.param a={sqrt((fc**2/fp**2)+1)}\n.param b={sqrt((fz**2/fc**2)+1)}\n.param R2={(a/b)*(fp*G)*(Rlower+Rupper)/((fp-fz)*Rlower*gm)}\n.param C1={1/(2*pi*R2*fz)}\n.param C2={Rlower*gm*(b/a)/(2*pi*fp*G*(Rlower+Rupper))}\n*\n*\n* Choose op amp characteristics *\n*\n.param AOL=90 ; open-loop gain in dB *\n.param POLE=30 ; low-frequency pole *\n.param VHIGH=5 ; upper output level *\n.param VLOW=100m ; lower output level *\n*\n* Do not edit these lines *\n*\n.param GAIN={10**(AOL/20)}\n.param COL={1/(6.28*(GAIN/100u)*POLE)}\n.param ROL={GAIN/100u}\n*

comptof.asc, the sub-circuit schematic file:
Version 4
SHEET 1 880 680
WIRE 64 192 -16 192
WIRE 224 192 144 192
WIRE -304 336 -368 336
WIRE -128 336 -176 336
WIRE 32 336 -48 336
WIRE -304 368 -304 336
WIRE 32 368 32 336
WIRE -176 384 -176 336
WIRE -304 496 -304 448
WIRE -176 496 -176 448
WIRE -176 496 -304 496
WIRE 32 496 32 448
WIRE 32 496 -176 496
WIRE 32 528 32 496
FLAG -16 192 NINV
IOPIN -16 192 In
FLAG 224 192 HYS
FLAG 32 528 0
FLAG -176 336 OUT
IOPIN -176 336 Out
FLAG -368 336 INV
IOPIN -368 336 In
SYMBOL bv 160 192 R90
WINDOW 0 -32 56 VBottom 2
WINDOW 3 32 56 VTop 2
SYMATTR InstName B1
SYMATTR Value V=IF(V(out) > ({VHIGH}+{VLOW})/2,{VHYS},0)
SYMBOL bv 32 352 R0
WINDOW 0 40 40 Left 2
WINDOW 3 42 70 Left 2
SYMATTR InstName B2
SYMATTR Value V=IF(V(HYS,INV)>0,{VHIGH},{VLOW})
SYMBOL res -32 320 R90
WINDOW 0 0 56 VBottom 2
WINDOW 3 32 56 VTop 2
SYMATTR InstName R1
SYMATTR Value 10
SYMBOL cap -192 384 R0
SYMATTR InstName C1
SYMATTR Value 10p
SYMBOL res -320 352 R0
SYMATTR InstName R2
SYMATTR Value 1Meg

The netlist it stands for:
* 3-phase PFC with switches - mul - load step.asc
Va a N SINE(0 {Vgpeak} {FLINE})
Vb b N SINE(0 {Vgpeak} {FLINE} 0 0 -120)
Vc c N SINE(0 {Vgpeak} {FLINE} 0 0 -240)
R1 N 0 1G
rla N008 N011 10m
rlb N009 N012 10m
rlc N010 N013 10m
H1 ia 0 VIa {Ri}
H2 ib 0 VIb {Ri}
H3 ic 0 VIc {Ri}
La N002 N008 500µ
Lb N003 N009 500µ
Lc N004 N010 500µ
VIa a N011 0
VIb b N012 0
VIc c N013 0
Sap N002 N001 Sap 0 TOFSW
San 0 N002 San 0 TOFSW
Sbp N003 N001 Sbp 0 TOFSW
Sbn 0 N003 Sbn 0 TOFSW
Scp N004 N001 Scp 0 TOFSW
Scn 0 N004 Scn 0 TOFSW
C1 N001 N005 820µ IC=390
R2 N005 0 2m
E1 va 0 a N 10m
E2 vb 0 b N 10m
E3 vc 0 c N 10m
R13 N001 0 {RL*2}
D1 N002 N001 TOFD
D2 0 N002 TOFD
D3 N003 N001 TOFD
D4 0 N003 TOFD
D5 N004 N001 TOFD
D6 0 N004 TOFD
X§X4 0 va N020 comptof params: VHIGH=5 VLOW=100m VHYS=10m
A2 0 N021 0 N025 0 0 R1 0 AND Vhigh=5 Vlow=0 Ref=2.5
A1 0 N030 0 N031 0 0 R2 0 AND Vhigh=5 Vlow=0 Ref=2.5
A3 0 N021 0 N034 0 0 R3 0 AND Vhigh=5 Vlow=0 Ref=2.5
A4 0 N024 0 N030 0 0 R4 0 AND Vhigh=5 Vlow=0 Ref=2.5
A5 0 N034 0 N025 0 0 R5 0 AND Vhigh=5 Vlow=0 Ref=2.5
A6 0 N024 0 N031 0 0 R6 0 AND Vhigh=5 Vlow=0 Ref=2.5
A7 0 N020 0 N020 0 N024 N021 0 AND Vhigh=5 Vlow=0 Ref=2.5
X§X5 0 vb N035 comptof params: VHIGH=5 VLOW=100m VHYS=10m
A8 0 N035 0 N035 0 N031 N034 0 AND Vhigh=5 Vlow=0 Ref=2.5
X§X6 0 vc N045 comptof params: VHIGH=5 VLOW=100m VHYS=10m
A9 0 N045 0 N045 0 N030 N025 0 AND Vhigh=5 Vlow=0 Ref=2.5
B1 RECa 0 V=abs(V(a,N))*{KBO}
B2 RECb 0 V=abs(V(b,N))*{KBO}
B3 RECc 0 V=abs(V(c,N))*{KBO}
B4 N022 0 V=-abs(V(ia))
R3 N023 N022 {ROCP}
X§X7 N014 N023 N015 opampTOF params: Vhigh=1.9 Vlow={VLOW} Col={COL} Rol={ROL}  ; pins - + OUT
R4 N014 0 2.2k
R5 N018 N014 2.2k
C2 N015 N018 33n
C3 N015 N014 650p
X§X8 N026 N015 N016 comptof params: VHIGH=5 VLOW=100m VHYS=10m
G1 0 N023 N027 0 {KMUL}
B5 N027 0 V=V(FB)*V(RECa)
R6 N041 N040 {ROCP}
X§X9 N032 N041 N033 opampTOF params: Vhigh=1.9 Vlow={VLOW} Col={COL} Rol={ROL}  ; pins - + OUT
R7 N032 0 2.2k
R8 N038 N032 2.2k
C4 N033 N038 33n
C5 N033 N032 650p
X§X13 N026 N033 N036 comptof params: VHIGH=5 VLOW=100m VHYS=10m
G2 0 N041 N042 0 {KMUL}
B6 N042 0 V=V(FB)*V(RECb)
B7 N040 0 V=-abs(V(ib))
R9 N054 N053 {ROCP}
X§X14 N046 N054 N047 opampTOF params: Vhigh=1.9 Vlow={VLOW} Col={COL} Rol={ROL}  ; pins - + OUT
R10 N046 0 2.2k
R11 N050 N046 2.2k
C6 N047 N050 33n
X§X15 N026 N047 N048 comptof params: VHIGH=5 VLOW=100m VHYS=10m
G3 0 N054 N057 0 {KMUL}
B8 N057 0 V=V(FB)*V(RECc)
B9 N053 0 V=-abs(V(ic))
C7 N047 N046 650p
V1 N026 0 PULSE(0 2 0 39.9u 1n 1n 40u)
A10 0 N016 0 N019 0 0 N017 0 AND Vhigh=5 Vlow=0 Ref=2.5
A11 0 N016 0 N028 0 0 N029 0 AND Vhigh=5 Vlow=0 Ref=2.5
A12 0 R1 0 R3 0 0 N019 0 OR Vhigh=5 Vlow=0 Ref=2.5
A13 0 R6 0 R4 0 0 N028 0 OR Vhigh=5 Vlow=0 Ref=2.5
A14 0 N036 0 N039 0 0 N037 0 AND Vhigh=5 Vlow=0 Ref=2.5
A15 0 N036 0 N043 0 0 N044 0 AND Vhigh=5 Vlow=0 Ref=2.5
A16 0 R3 0 R5 0 0 N039 0 OR Vhigh=5 Vlow=0 Ref=2.5
A17 0 R6 0 R2 0 0 N043 0 OR Vhigh=5 Vlow=0 Ref=2.5
A18 0 N048 0 N051 0 0 N049 0 AND Vhigh=5 Vlow=0 Ref=2.5
A19 0 N048 0 N059 0 0 N060 0 AND Vhigh=5 Vlow=0 Ref=2.5
A20 0 R1 0 R5 0 0 N051 0 OR Vhigh=5 Vlow=0 Ref=2.5
A21 0 R4 0 R2 0 0 N059 0 OR Vhigh=5 Vlow=0 Ref=2.5
R12 San N017 10
C8 San 0 100p
R14 Sap N029 10
C9 Sap 0 100p
R15 Sbn N037 10
R16 Sbp N044 10
R17 Scn N049 10
R18 Scp N060 10
C10 Scn 0 100p
C11 Scp 0 100p
C12 Sbn 0 100p
C13 Sbp 0 100p
R19 N001 Div {Rupper}
R20 Div 0 {Rlower}
V2 N052 0 {Vref}
C14 N058 FB {C1}
R21 0 N058 {R2}
C15 0 FB {C2}
G4 0 FB N052 Div {gm}
R22 FB 0 10G
V3 N055 0 100m
V4 N056 0 5
D7 N055 FB DOTA
D8 FB N056 DOTA
R23 N001 Vout 1k
C16 Vout 0 1n
S§TOFSW 0 N006 N007 0 TOFSW
R24 N001 N006 {RL*2}
V5 N007 0 PWL(0 0 100m 0 100.01m 5 140m 5 140.01m 0)

* block symbol definitions
.subckt comptof INV NINV OUT
B1 HYS NINV V=IF(V(out) > ({VHIGH}+{VLOW})/2,{VHYS},0)
B2 N001 0 V=IF(V(HYS,INV)>0,{VHIGH},{VLOW})
R1 N001 OUT 10
C1 OUT 0 10p
R2 INV 0 1Meg
.ends comptof

.model D D
.lib standard.dio
*
.PARAM Fline=50
.param Vgrms=120
.PARAM Vgpeak={Vgrms*sqrt(2)}
.PARAM Vamp={Vgpeak*2}
.PARAM Vout=400
.PARAM Pout=10k
.PARAM RL={Vout**2/Pout}
*
.MODEL TOFSW SW(Ron=25m Roff=10Meg Vt=2 Vh=1)
.MODEL TOFD D(IS=10e-18 RS=16m CJO=500p
+M=0.4 VJ=0.75 ISR=720n BV=1000 IBV=100u TT=130n)
.model dota D Rs=1 TT=100n N=100m
*
.param Ri=110m
.param KBO=10m
.param KMUL=3.5m
.param ROCP=2k
*
.tran 0 160m 85m uic
.four 50 10 -1 I(Via)
.four 50 10 -1 I(Vib)
.four 50 10 -1 I(Vic)
.options abstol=1u vntol=1m reltol=0.01 gmin=100p
+method=gear
*
.param Gfc=28 ; magnitude at crossover *
.param PS=-76 ; phase lag at crossover *
*
* Enter Design Goals Information Here *
*
.param fc=100 ; targeted crossover *
.param PM=70 ; choose phase margin at crossover *
*
*
* Enter the Values for Vout and Bridge Bias Current *
*
.param Ibias=250u
.param Vref=2.5
*
* Do not edit the below lines *
*
.param gm=100u ; transconductance in Siemens *
.param Rlower={Vref/Ibias}
.param Rupper={(Vout-Vref)/Ibias}
.param boost={PM-PS-90}
.param G={10**(-Gfc/20)}
.param kf={tan((boost/2+45)*pi/180)}
.param fp={fc*kf}
.param fz={fc/kf}
.param a={sqrt((fc**2/fp**2)+1)}
.param b={sqrt((fz**2/fc**2)+1)}
.param R2={(a/b)*(fp*G)*(Rlower+Rupper)/((fp-fz)*Rlower*gm)}
.param C1={1/(2*pi*R2*fz)}
.param C2={Rlower*gm*(b/a)/(2*pi*fp*G*(Rlower+Rupper))}
*
*
* Choose op amp characteristics *
*
.param AOL=90 ; open-loop gain in dB *
.param POLE=30 ; low-frequency pole *
.param VHIGH=5 ; upper output level *
.param VLOW=100m ; lower output level *
*
* Do not edit these lines *
*
.param GAIN={10**(AOL/20)}
.param COL={1/(6.28*(GAIN/100u)*POLE)}
.param ROL={GAIN/100u}
*
.backanno
.end